# EAGLE design ANET3D_LCD12864_Board (EAGLE 6.6.0)
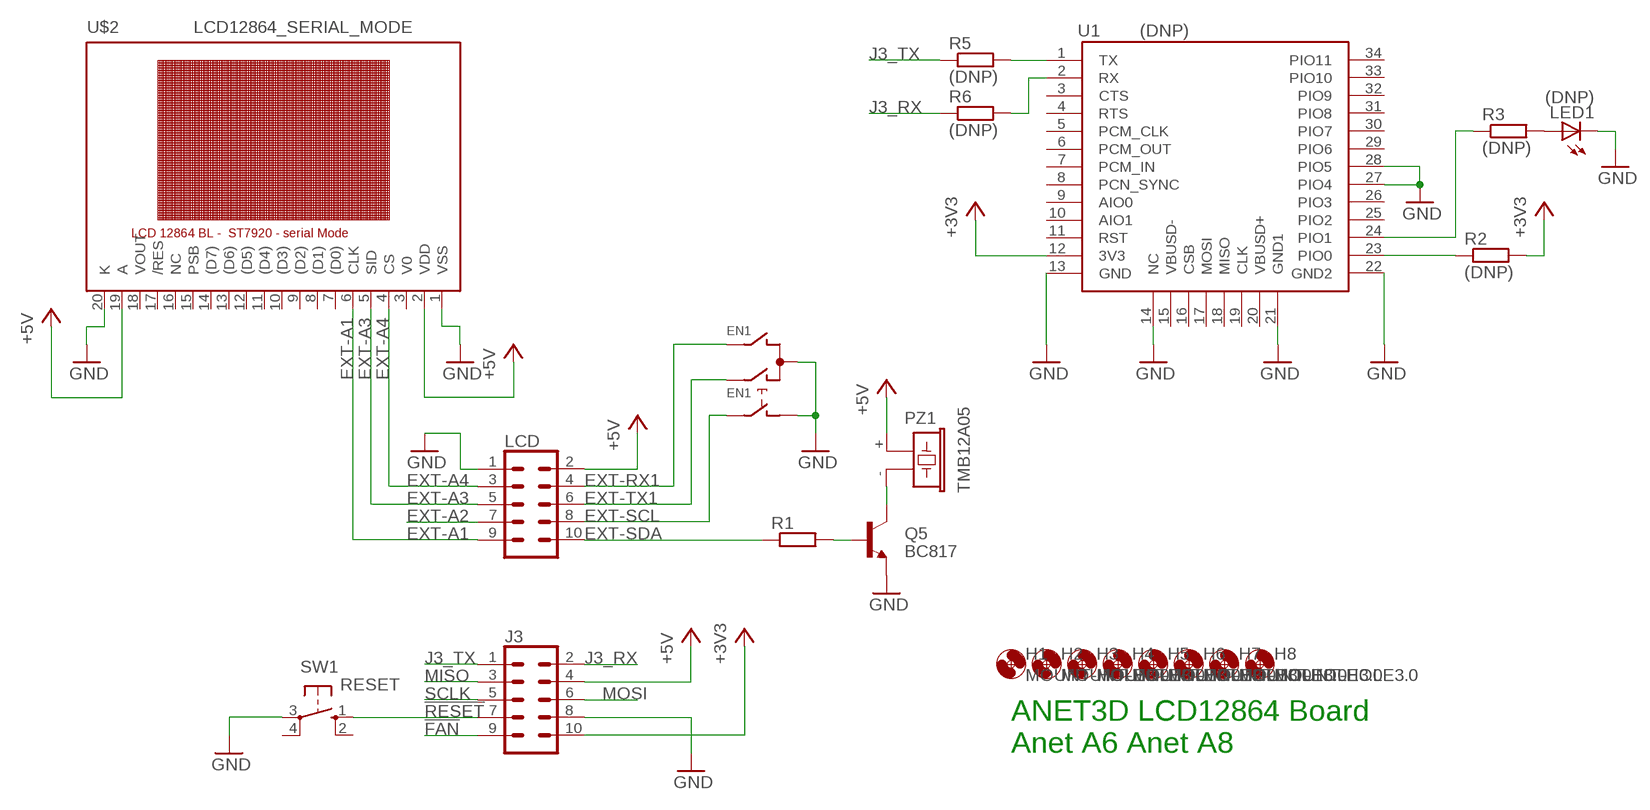
[diagram p0: schematic, sheet 1]

## Parts
EN1  EC12E_SW  [ALPS_EC12E_SW]
H1  MOUNT-HOLE3.0  [3,0]
H2  MOUNT-HOLE3.0  [3,0]
H3  MOUNT-HOLE3.0  [3,0]
H4  MOUNT-HOLE3.0  [3,0]
H5  MOUNT-HOLE3.0  [3,0]
H6  MOUNT-HOLE3.0  [3,0]
H7  MOUNT-HOLE3.0  [3,0]
H8  MOUNT-HOLE3.0  [3,0]
J3  CONN_05X2SHD_SMD  [2X5-SHROUDED_SMD]
LCD  CONN_05X2SHD_SMD  [2X5-SHROUDED_SMD]
LED1  (DNP)  LEDCHIPLED_0805  [CHIPLED_0805]
PZ1  TMB12A05  F/CM12P  [F/CM12P]
Q5  BC817  BC817-40LT1SMD  [SOT23-BEC]
R1  R-EU_R0805  [R0805]
R2  (DNP)  R-EU_R0805  [R0805]
R3  (DNP)  R-EU_R0805  [R0805]
R5  (DNP)  R-EU_R0805  [R0805]
R6  (DNP)  R-EU_R0805  [R0805]
SW1  RESET  40-XX  [B3F-40XX]
U1  (DNP)  HC_05  [BLUETOOTH_SMD]
U$2  LCD12864_SERIAL_MODE  [LCD12864]

## Nets
!FAN: J3.9
!RESET: J3.7 SW1.1(S)
+3V3: J3.10 R2.2 U1.12(3V3)
+5V [power]: J3.4 LCD.2 PZ1.+ U$2.2(VDD) U$2.19(A)
EXT-A1: LCD.9 U$2.6(CLK)
EXT-A2: LCD.7
EXT-A3: LCD.5 U$2.5(SID)
EXT-A4: LCD.3 U$2.4(CS)
EXT-RX1: EN1.B LCD.4
EXT-SCL: EN1.E LCD.8
EXT-SDA: LCD.10 R1.1
EXT-TX1: EN1.A LCD.6
GND: EN1.C EN1.D J3.8 LCD.1 LED1.C Q5.E SW1.3(P) U1.13(GND) U1.14(NC) U1.21(GND1) U1.22(GND2) U1.27(PIO4) U1.28(PIO5) U$2.1(VSS) U$2.20(K)
J3_RX: J3.2 R6.1
J3_TX: J3.1 R5.1
MISO: J3.3
MOSI: J3.6
N$1: Q5.B R1.2
N$2: R3.1 U1.24(PIO1)
N$3: PZ1.- Q5.C
N$4: LED1.A R3.2
N$5: R5.2 U1.1(TX)
N$6: R6.2 U1.2(RX)
N$7: R2.1 U1.23(PIO0)
SCLK: J3.5
Unconnected: EN1.GND1(G) EN1.GND2(G) SW1.2(S1) SW1.4(P1) U1.3(CTS) U1.4(RTS) U1.5(PCM_CLK) U1.6(PCM_OUT) U1.7(PCM_IN) U1.8(PCN_SYNC) U1.9(AIO0) U1.10(AIO1) U1.11(RST) U1.15(VBUSD-) U1.16(CSB) U1.17(MOSI) U1.18(MISO) U1.19(CLK) U1.20(VBUSD+) U1.25(PIO2) U1.26(PIO3) U1.29(PIO6) U1.30(PIO7) U1.31(PIO8) U1.32(PIO9) U1.33(PIO10) U1.34(PIO11) U$2.3(V0) U$2.7((D0)) U$2.8((D1)) U$2.9((D2)) U$2.10((D3)) U$2.11((D4)) U$2.12((D5)) U$2.13((D6)) U$2.14((D7)) U$2.15(PSB) U$2.16(NC) U$2.17(/RES) U$2.18(VOUT)

## Notes on the sheet
- ANET3D LCD12864 Board 
  Anet A6 Anet A8

## Library data of the parts
EN1 = switch-alps:EC12E_SW: ALPS rotary Encoder EC12E series with switch; MPN: EC12E2424407; OC_FARNELL: 1520813; OC_NEWARK: 74M1068
H1-H8 = holes:MOUNT-HOLE: MOUNTING HOLE with drill center marker
J3 LCD = SparkFun-Connectors:CONN_05X2: Multi connection point. Often used as Generic Header-pin footprint for 0.1 inch spaced/style header connections For AVR SPI programming port, see special device with nice symbol: "AVR_SPI_PROG_5x2.dev" You can populate with any combo of single row headers, but if you'd like an exact match, check these: 2x5 AVR ICSP Male Header <https://www.sparkfun.com/products/778> (PRT-00778) 2x5 Pin Shrouded Header <https://www.sparkfun.com/products/8506> (PRT-08506) On any of the 0.1 inch spaced packages, you can populate with these: Break Away Headers - Straight <https://www.sparkfun.com/products/116> (PRT-00116) Break Away Male Headers - Right Angle <https://www.sparkfun.com/products/553> (PRT-00553) Female Headers <https://www.sparkfun.com/products/115> (PRT-00115) Break Away Headers - Machine Pin <https://www.sparkfun.com/products/117> (PRT-00117) Break Away Female Headers - Swiss Machine Pin <https://www.sparkfun.com/products/743> (PRT-00743) Special note: the shrouded connector mates well with our 5x2 ribbon cables: 2x5 Pin IDC Ribbon Cable <https://www.sparkfun.com/products/8535> (PRT-08535); PROD_ID: CONN-09508
LED1 = led:LED: LED OSRAM: - CHIPLED LG R971, LG N971, LY N971, LG Q971, LY Q971, LO R971, LY R971 LH N974, LH R974 LS Q976, LO Q976, LY Q976 LO Q996 - Hyper CHIPLED LW Q18S LB Q993, LB Q99A, LB R99A - SideLED LS A670, LO A670, LY A670, LG A670, LP A670 LB A673, LV A673, LT A673, LW A673 LH A674 LY A675 LS A676, LA A676, LO A676, LY A676, LW A676 LS A679, LY A679, LG A679 - Hyper Micro SIDELED® LS Y876, LA Y876, LO Y876, LY Y876 LT Y87S - SmartLED LW L88C, LW L88S LB L89C, LB L89S, LG L890 LS L89K, LO L89K, LY L89K LS L896, LA L896, LO L896, LY L896 - TOPLED LS T670, LO T670, LY T670, LG T670, LP T670 LSG T670, LSP T670, LSY T670, LOP T670, LYG T670 LG T671, LOG T671, LSG T671 LB T673, LV T673, LT T673, LW T673 LH T674 LS T676, LA T676, LO T676, LY T676, LB T676, LH T676, LSB T676, LW T676 LB T67C, LV T67C, LT T67C, LS T67K, LO T67K, LY T67K, LW E67C LS E67B, LA E67B, LO E67B, LY E67B, LB E67C, LV E67C, LT E67C LW T67C LS T679, LY T679, LG T679 LS T770, LO T770, LY T770, LG T770, LP T770 LB T773, LV T773, LT T773, LW T773 LH T774 LS E675, LA E675, LY E675, LS T675 LS T776, LA T776, LO T776, LY T776, LB T776 LHGB T686 LT T68C, LB T68C - Hyper Mini TOPLED® LB M676 - Mini TOPLED Santana® LG M470 LS M47K, LO M47K, LY M47K Source: http://www.osram.convergy.de LUXEON: - LUMILED® LXK2-PW12-R00, LXK2-PW12-S00, LXK2-PW14-U00, LXK2-PW14-V00 LXK2-PM12-R00, LXK2-PM12-S00, LXK2-PM14-U00 LXK2-PE12-Q00, LXK2-PE12-R00, LXK2-PE12-S00, LXK2-PE14-T00, LXK2-PE14-U00 LXK2-PB12-K00, LXK2-PB12-L00, LXK2-PB12-M00, LXK2-PB14-N00, LXK2-PB14-P00, LXK2-PB14-Q00 LXK2-PR12-L00, LXK2-PR12-M00, LXK2-PR14-Q00, LXK2-PR14-R00 LXK2-PD12-Q00, LXK2-PD12-R00, LXK2-PD12-S00 LXK2-PH12-R00, LXK2-PH12-S00 LXK2-PL12-P00, LXK2-PL12-Q00, LXK2-PL12-R00 Source: www.luxeon.com KINGBRIGHT: KA-3528ASYC Source: www.kingbright.com
PZ1 = buzzer:F/CM12P: BUZZER Source: Buerklin; OC_FARNELL: unknown; OC_NEWARK: unknown
Q5 = transistor-npn:BC817*: NPN Transistor
R1-R3 R5 R6 = rcl:R-EU_: RESISTOR, European symbol
SW1 = switch-omron:40-XX: OMRON SWITCH; MF: OMRON COMPONENTS USA; MPN: B3F-4000; OC_FARNELL: 176434; OC_NEWARK: 36K3105
U1 = SerialPortBluetooth_HC-05:HC_05
U$2 = LCD12864:LCD12864_SERIAL_MODE: LCD 12864 Dots Module (5V Blue Backlight) - Type HJ12864ZW 128x64 DOTS LCD Module 5V Blue Screen 12864 LCD Backlight ST0920 Parallel Port (in SERIALl PPORT MODE, PSB=L)

## Board
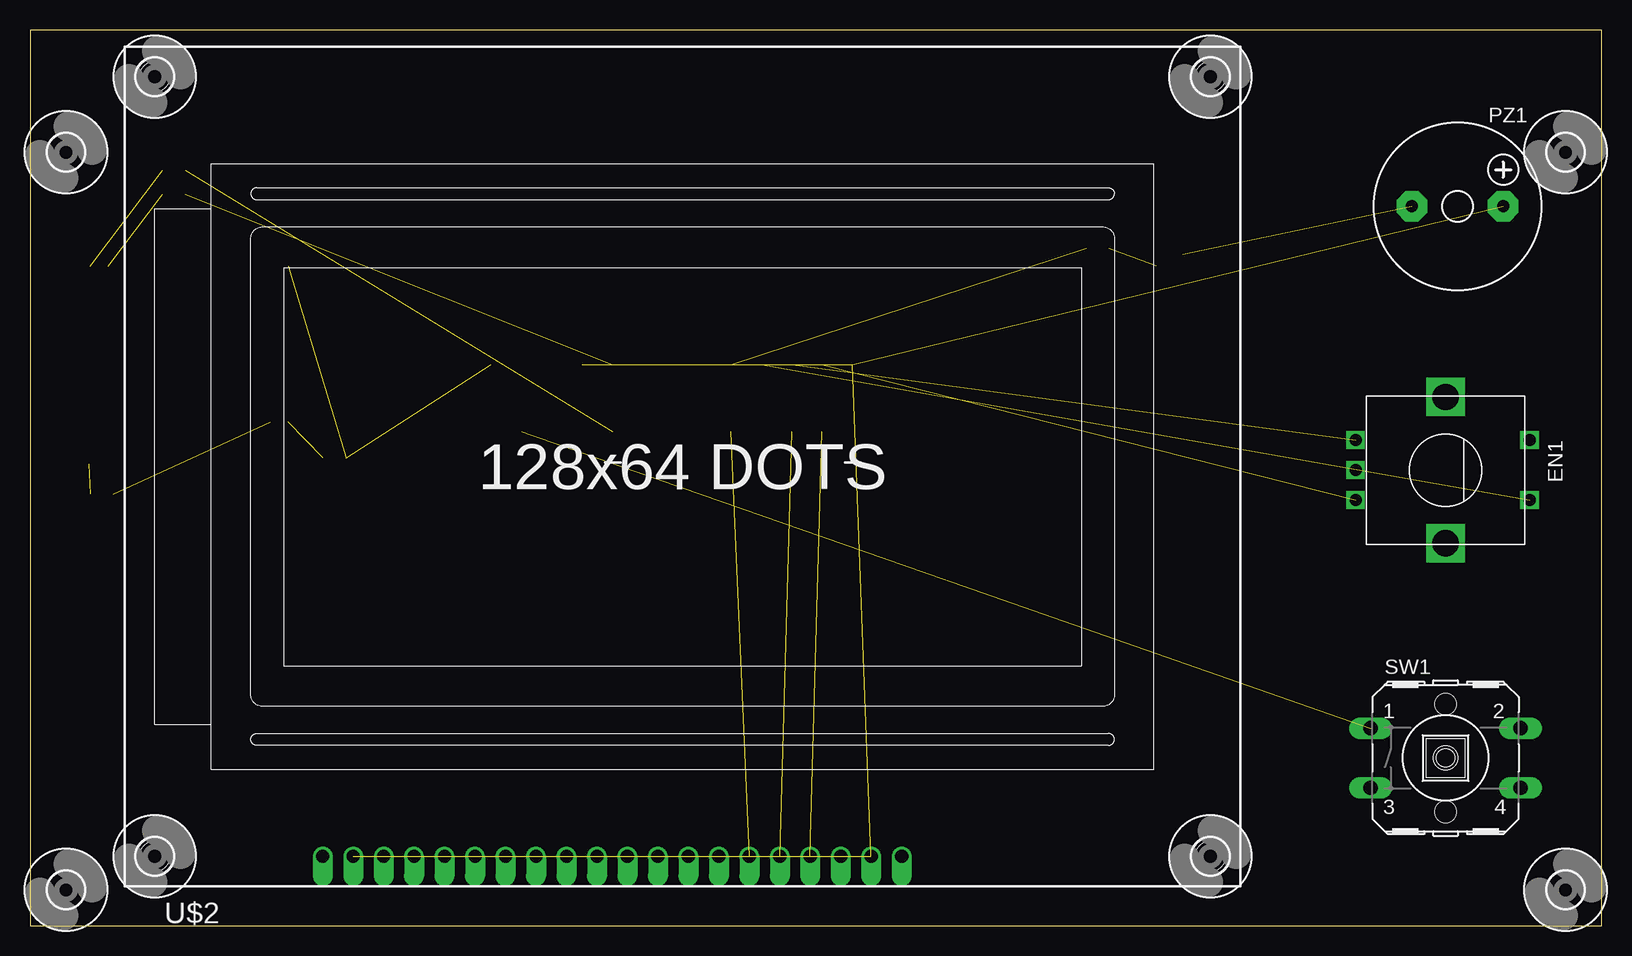
[diagram p1: board, top side]
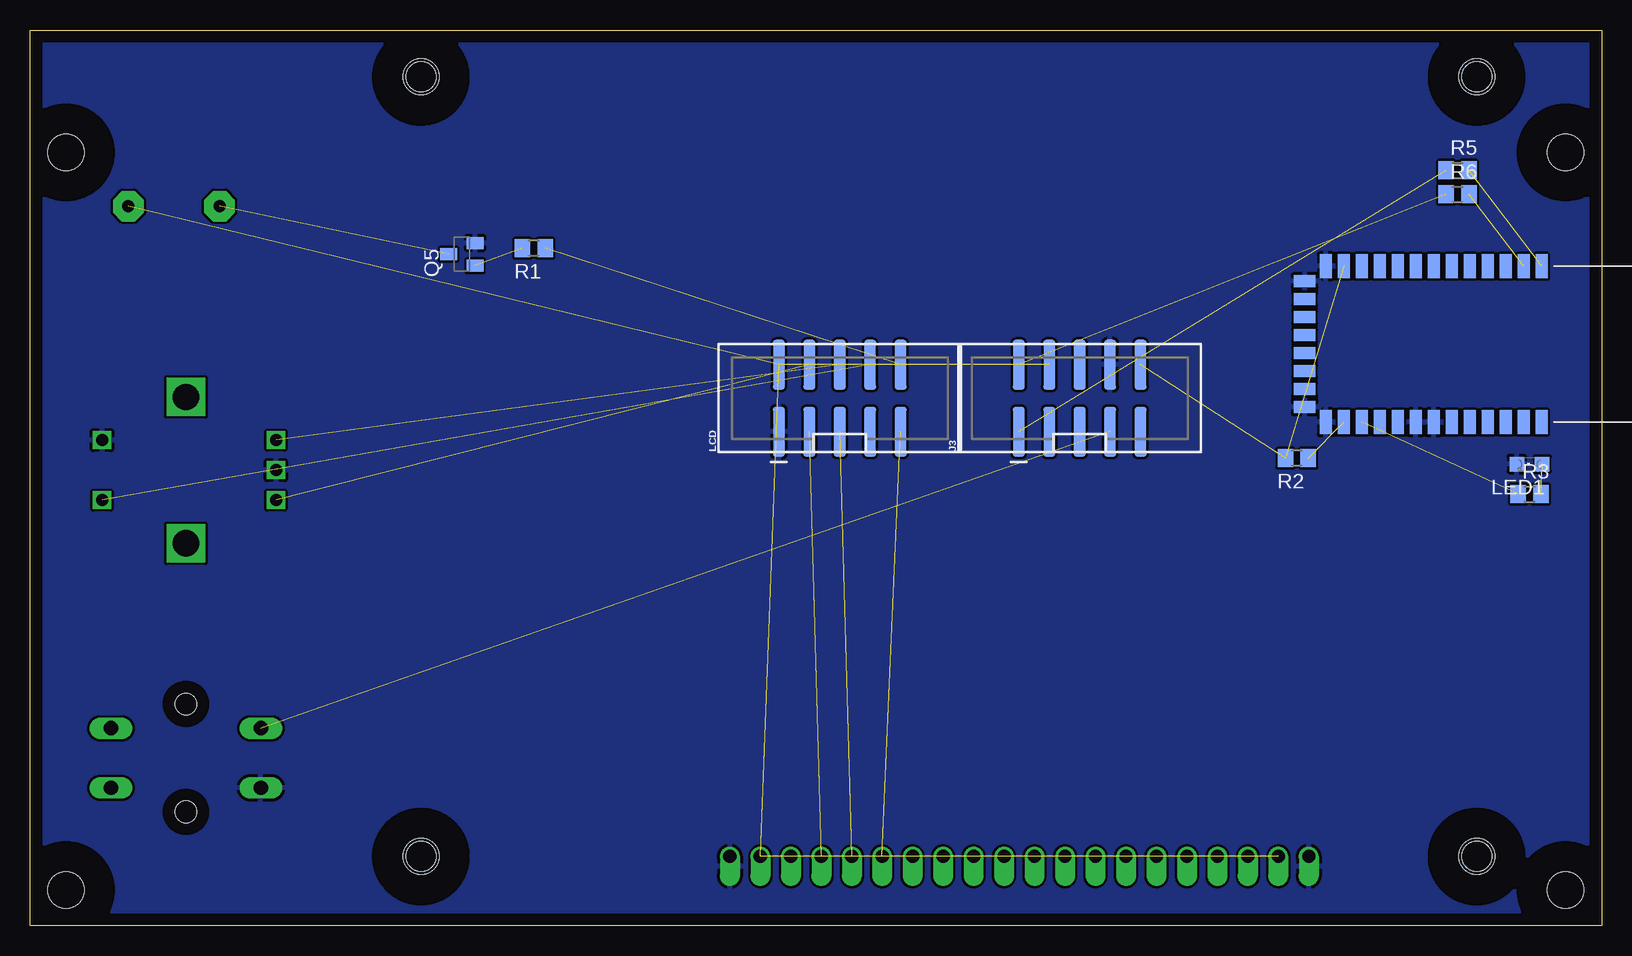
[diagram p2: board, bottom side, seen from below]

Size 131 x 74.7 mm. Coordinates in mm from the lower left corner, seen from the top.
Outline: 0,0 131,0 131,74.7 0,74.7 0,0
Copper layers (1*16): Top 0.035mm / dielectric 1.5mm / Bottom 0.035mm
Design rules "default": minimum track width 10mil, minimum drill 24mil, track to track 8mil, track to pad 8mil, pad to pad 8mil, via to via 8mil, smd to smd 8mil, copper to edge 40mil, drill to drill 8mil, minimum pad ring 10mil, minimum via ring 8mil, stop-mask expansion 4mil, vias tented up to drill 0mil, thermal gap 10mil

### Footprints (pad centres in the part's own frame; a part is rotated, then mirrored left to right if it is on the bottom)
ALPS_EC12E_SW = drill 1 square: A -2.5,-7.5; B 2.5,-7.5; C 0,-7.5; D -2.5,7; E 2.5,7 | drill 2.2 square: GND1 -6.1,0; GND2 6.1,0
3,0 = hole 3: 0,0
2X5-SHROUDED_SMD = smd 4.15 x 1: 1 -2.794,5.08; 2 2.794,5.08; 3 -2.794,2.54; 4 2.794,2.54; 5 -2.794,0; 6 2.794,0; 7 -2.794,-2.54; 8 2.794,-2.54; 9 -2.794,-5.08; 10 2.794,-5.08
CHIPLED_0805 = smd 1.2 x 1.2: A 0,-1.05; C 0,1.05
F/CM12P = drill 1.016 pad 2.54 octagon: + 3.81,0; - -3.81,0
SOT23-BEC = smd 1 x 1.4: B -0.95,-1.1; C 0,1.1; E 0.95,-1.1
R0805 = smd 1.3 x 1.5: 1 -0.95,0; 2 0.95,0
B3F-40XX = drill 1.194 long: 1 -6.248,2.489; 2 6.248,2.489; 3 -6.248,-2.489; 4 6.248,-2.489 | hole 1.803: 0,-4.496; 0,4.496
BLUETOOTH_SMD = smd 2 x 1: 1 0,0; 2 0,-1.5; 3 0,-3; 4 0,-4.5; 5 0,-6; 6 0,-7.5; 7 0,-9; 8 0,-10.5; 9 0,-12; 10 0,-13.5; 11 0,-15; 12 0,-16.5; 13 0,-18; 22 13,-18; 23 13,-16.5; 24 13,-15; 25 13,-13.5; 26 13,-12; 27 13,-10.5; 28 13,-9; 29 13,-7.5; 30 13,-6; 31 13,-4.5; 32 13,-3; 33 13,-1.5; 34 13,0 | smd 1 x 1.8: 14 1.25,-19.75; 15 2.75,-19.75; 16 4.25,-19.75; 17 5.75,-19.75; 18 7.25,-19.75; 19 8.75,-19.75; 20 10.25,-19.75; 21 11.75,-19.75
LCD12864 = drill 1.1 offset: 1 18.26,-32.5; 2 15.72,-32.5; 3 13.18,-32.5; 4 10.64,-32.5; 5 8.1,-32.5; 6 5.56,-32.5; 7 3.02,-32.5; 8 0.48,-32.5; 9 -2.06,-32.5; 10 -4.6,-32.5; 11 -7.14,-32.5; 12 -9.68,-32.5; 13 -12.22,-32.5; 14 -14.76,-32.5; 15 -17.3,-32.5; 16 -19.84,-32.5; 17 -22.38,-32.5; 18 -24.92,-32.5; 19 -27.46,-32.5; 20 -30,-32.5 | hole 2.5: -44,-32.5; -44,32.5; 44,32.5; 44,-32.5

### Placement (x,y rotation side)
EN1  118,38 270 top
H1  98.4,5.8 0 top
H2  98.4,70.8 0 top
H3  10.4,70.8 0 top
H4  10.4,5.8 0 top
H5  128,64.5 0 top
H6  3,64.5 0 top
H7  128,3 0 top
H8  3,3 0 top
J3  43.5,44 90 bottom
LCD  63.5,44 90 bottom
LED1  6,38.5 90 bottom
PZ1  119,60 0 top
Q5  95,56 90 bottom
R1  89,56.5 180 bottom
R2  25.4,39 180 bottom
R3  6,36 0 bottom
R5  12,63 0 bottom
R6  12,61 0 bottom
SW1  118,14 0 top
U1  5,55 270 bottom
U$2  54.4,38.3 0 top

### Tracks (layer width: path | path; a pad name or v marks a point on that pad's centre or on a via)
!RESET  (1 unrouted)
+3V3  (2 unrouted)
+5V  (4 unrouted)
EXT-A1  (1 unrouted)
EXT-A3  (1 unrouted)
EXT-A4  (1 unrouted)
EXT-RX1  (1 unrouted)
EXT-SCL  (1 unrouted)
EXT-SDA  (1 unrouted)
EXT-TX1  (1 unrouted)
GND
  pour Bottom: 0,74.93 132.08,74.93 132.08,-1.27 0,-1.27
J3_RX  (1 unrouted)
J3_TX  (1 unrouted)
N$1  (1 unrouted)
N$2  (1 unrouted)
N$3  (1 unrouted)
N$4  (1 unrouted)
N$5  (1 unrouted)
N$6  (1 unrouted)
N$7  (1 unrouted)